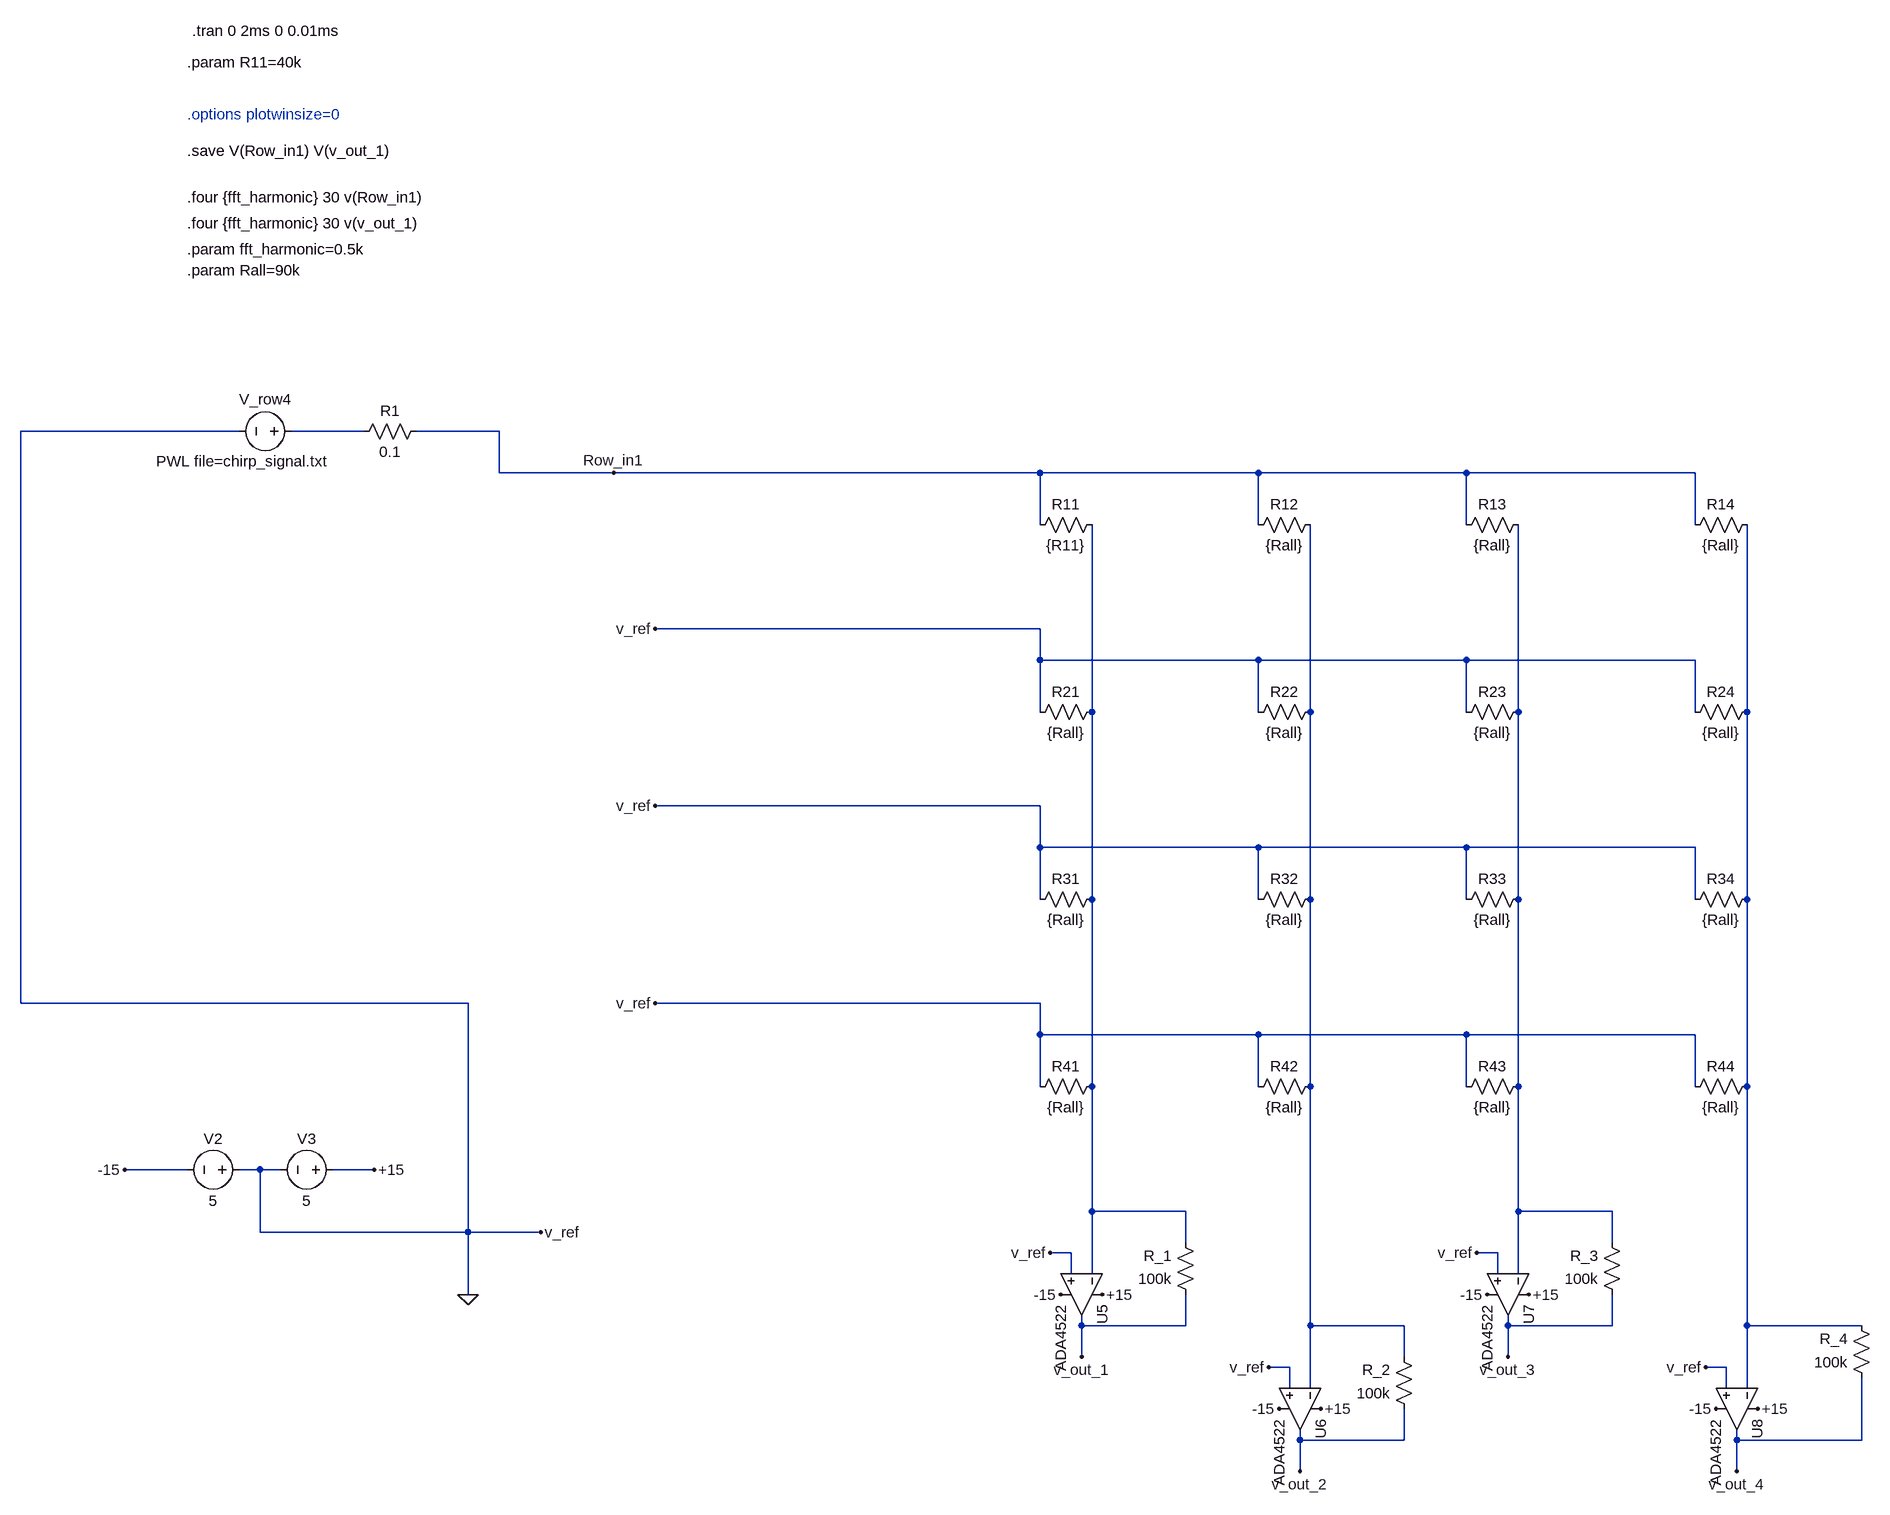
[diagram p0: schematic 06_Linear_Chirp.asc]
06_Linear_Chirp.asc, the LTspice schematic file:
Version 4
SHEET 1 880 880
WIRE -4512 -896 -4848 -896
WIRE -4320 -896 -4432 -896
WIRE -4112 -896 -4240 -896
WIRE -4112 -832 -4112 -896
WIRE -3936 -832 -4112 -832
WIRE -3280 -832 -3936 -832
WIRE -2944 -832 -3280 -832
WIRE -2624 -832 -2944 -832
WIRE -2272 -832 -2624 -832
WIRE -3280 -752 -3280 -832
WIRE -2944 -752 -2944 -832
WIRE -2624 -752 -2624 -832
WIRE -2272 -752 -2272 -832
WIRE -3280 -592 -3872 -592
WIRE -3280 -544 -3280 -592
WIRE -2944 -544 -3280 -544
WIRE -2624 -544 -2944 -544
WIRE -2272 -544 -2624 -544
WIRE -3280 -464 -3280 -544
WIRE -3200 -464 -3200 -752
WIRE -2944 -464 -2944 -544
WIRE -2864 -464 -2864 -752
WIRE -2624 -464 -2624 -544
WIRE -2544 -464 -2544 -752
WIRE -2272 -464 -2272 -544
WIRE -2192 -464 -2192 -752
WIRE -3280 -320 -3872 -320
WIRE -3280 -256 -3280 -320
WIRE -2944 -256 -3280 -256
WIRE -2624 -256 -2944 -256
WIRE -2272 -256 -2624 -256
WIRE -3280 -176 -3280 -256
WIRE -3200 -176 -3200 -464
WIRE -2944 -176 -2944 -256
WIRE -2864 -176 -2864 -464
WIRE -2624 -176 -2624 -256
WIRE -2544 -176 -2544 -464
WIRE -2272 -176 -2272 -256
WIRE -2192 -176 -2192 -464
WIRE -4848 -16 -4848 -896
WIRE -4160 -16 -4848 -16
WIRE -3280 -16 -3872 -16
WIRE -3280 32 -3280 -16
WIRE -2944 32 -3280 32
WIRE -2624 32 -2944 32
WIRE -2272 32 -2624 32
WIRE -3280 112 -3280 32
WIRE -3200 112 -3200 -176
WIRE -2944 112 -2944 32
WIRE -2864 112 -2864 -176
WIRE -2624 112 -2624 32
WIRE -2544 112 -2544 -176
WIRE -2272 112 -2272 32
WIRE -2192 112 -2192 -176
WIRE -4592 240 -4688 240
WIRE -4480 240 -4512 240
WIRE -4448 240 -4480 240
WIRE -4304 240 -4368 240
WIRE -3200 304 -3200 112
WIRE -3056 304 -3200 304
WIRE -2544 304 -2544 112
WIRE -2400 304 -2544 304
WIRE -4480 336 -4480 240
WIRE -4160 336 -4160 -16
WIRE -4160 336 -4480 336
WIRE -4048 336 -4160 336
WIRE -3056 352 -3056 304
WIRE -2400 352 -2400 304
WIRE -3232 368 -3264 368
WIRE -2576 368 -2608 368
WIRE -3232 400 -3232 368
WIRE -3200 400 -3200 304
WIRE -2576 400 -2576 368
WIRE -2544 400 -2544 304
WIRE -4160 432 -4160 336
WIRE -3216 480 -3216 464
WIRE -3056 480 -3056 432
WIRE -3056 480 -3216 480
WIRE -2864 480 -2864 112
WIRE -2720 480 -2864 480
WIRE -2560 480 -2560 464
WIRE -2400 480 -2400 432
WIRE -2400 480 -2560 480
WIRE -2192 480 -2192 112
WIRE -2016 480 -2192 480
WIRE -3216 528 -3216 480
WIRE -2720 528 -2720 480
WIRE -2560 528 -2560 480
WIRE -2896 544 -2928 544
WIRE -2224 544 -2256 544
WIRE -2896 576 -2896 544
WIRE -2864 576 -2864 480
WIRE -2224 576 -2224 544
WIRE -2192 576 -2192 480
WIRE -2880 656 -2880 640
WIRE -2720 656 -2720 608
WIRE -2720 656 -2880 656
WIRE -2208 656 -2208 640
WIRE -2016 656 -2016 560
WIRE -2016 656 -2208 656
WIRE -2880 704 -2880 656
WIRE -2208 704 -2208 656
FLAG -4160 432 0
FLAG -4304 240 +15
FLAG -4688 240 -15
FLAG -3184 432 +15
FLAG -3248 432 -15
FLAG -3264 368 v_ref
FLAG -4048 336 v_ref
FLAG -2848 608 +15
FLAG -2912 608 -15
FLAG -2928 544 v_ref
FLAG -2528 432 +15
FLAG -2592 432 -15
FLAG -2608 368 v_ref
FLAG -2176 608 +15
FLAG -2240 608 -15
FLAG -2256 544 v_ref
FLAG -3216 528 v_out_1
FLAG -2880 704 v_out_2
FLAG -2560 528 v_out_3
FLAG -2208 704 v_out_4
FLAG -3936 -832 Row_in1
FLAG -3872 -16 v_ref
FLAG -3872 -320 v_ref
FLAG -3872 -592 v_ref
SYMBOL voltage -4496 240 R90
WINDOW 0 -32 56 VBottom 2
WINDOW 3 32 56 VTop 2
WINDOW 123 0 0 Left 0
WINDOW 39 0 0 Left 0
SYMATTR InstName V2
SYMATTR Value 5
SYMBOL voltage -4352 240 R90
WINDOW 0 -32 56 VBottom 2
WINDOW 3 32 56 VTop 2
WINDOW 123 0 0 Left 0
WINDOW 39 0 0 Left 0
SYMATTR InstName V3
SYMATTR Value 5
SYMBOL res -3184 -768 R90
WINDOW 0 0 56 VBottom 2
WINDOW 3 32 56 VTop 2
SYMATTR InstName R11
SYMATTR Value {R11}
SYMBOL res -2848 -768 R90
WINDOW 0 0 56 VBottom 2
WINDOW 3 32 56 VTop 2
SYMATTR InstName R12
SYMATTR Value {Rall}
SYMBOL res -2528 -768 R90
WINDOW 0 0 56 VBottom 2
WINDOW 3 32 56 VTop 2
SYMATTR InstName R13
SYMATTR Value {Rall}
SYMBOL res -2176 -768 R90
WINDOW 0 0 56 VBottom 2
WINDOW 3 32 56 VTop 2
SYMATTR InstName R14
SYMATTR Value {Rall}
SYMBOL res -3184 -480 R90
WINDOW 0 0 56 VBottom 2
WINDOW 3 32 56 VTop 2
SYMATTR InstName R21
SYMATTR Value {Rall}
SYMBOL res -2848 -480 R90
WINDOW 0 0 56 VBottom 2
WINDOW 3 32 56 VTop 2
SYMATTR InstName R22
SYMATTR Value {Rall}
SYMBOL res -2528 -480 R90
WINDOW 0 0 56 VBottom 2
WINDOW 3 32 56 VTop 2
SYMATTR InstName R23
SYMATTR Value {Rall}
SYMBOL res -2176 -480 R90
WINDOW 0 0 56 VBottom 2
WINDOW 3 32 56 VTop 2
SYMATTR InstName R24
SYMATTR Value {Rall}
SYMBOL res -3184 -192 R90
WINDOW 0 0 56 VBottom 2
WINDOW 3 32 56 VTop 2
SYMATTR InstName R31
SYMATTR Value {Rall}
SYMBOL res -2848 -192 R90
WINDOW 0 0 56 VBottom 2
WINDOW 3 32 56 VTop 2
SYMATTR InstName R32
SYMATTR Value {Rall}
SYMBOL res -2528 -192 R90
WINDOW 0 0 56 VBottom 2
WINDOW 3 32 56 VTop 2
SYMATTR InstName R33
SYMATTR Value {Rall}
SYMBOL res -2176 -192 R90
WINDOW 0 0 56 VBottom 2
WINDOW 3 32 56 VTop 2
SYMATTR InstName R34
SYMATTR Value {Rall}
SYMBOL res -3184 96 R90
WINDOW 0 0 56 VBottom 2
WINDOW 3 32 56 VTop 2
SYMATTR InstName R41
SYMATTR Value {Rall}
SYMBOL res -2848 96 R90
WINDOW 0 0 56 VBottom 2
WINDOW 3 32 56 VTop 2
SYMATTR InstName R42
SYMATTR Value {Rall}
SYMBOL res -2528 96 R90
WINDOW 0 0 56 VBottom 2
WINDOW 3 32 56 VTop 2
SYMATTR InstName R43
SYMATTR Value {Rall}
SYMBOL res -2176 96 R90
WINDOW 0 0 56 VBottom 2
WINDOW 3 32 56 VTop 2
SYMATTR InstName R44
SYMATTR Value {Rall}
SYMBOL res -3040 448 R180
WINDOW 0 36 76 Left 2
WINDOW 3 36 40 Left 2
SYMATTR InstName R_1
SYMATTR Value 100k
SYMBOL res -2704 624 R180
WINDOW 0 36 76 Left 2
WINDOW 3 36 40 Left 2
SYMATTR InstName R_2
SYMATTR Value 100k
SYMBOL res -2384 448 R180
WINDOW 0 36 76 Left 2
WINDOW 3 36 40 Left 2
SYMATTR InstName R_3
SYMATTR Value 100k
SYMBOL res -2000 576 R180
WINDOW 0 36 76 Left 2
WINDOW 3 36 40 Left 2
SYMATTR InstName R_4
SYMATTR Value 100k
SYMBOL OpAmps\\ADA4522 -3152 432 R90
SYMATTR InstName U5
SYMBOL OpAmps\\ADA4522 -2816 608 R90
SYMATTR InstName U6
SYMBOL OpAmps\\ADA4522 -2496 432 R90
SYMATTR InstName U7
SYMBOL OpAmps\\ADA4522 -2144 608 R90
SYMATTR InstName U8
SYMBOL voltage -4416 -896 R90
WINDOW 3 46 -41 VRight 2
WINDOW 0 -49 14 VRight 2
WINDOW 39 0 0 Left 0
SYMATTR Value PWL file=chirp_signal.txt
SYMATTR InstName V_row4
SYMATTR Value2 AC .1
SYMBOL res -4224 -912 R90
WINDOW 0 0 56 VBottom 2
WINDOW 3 32 56 VTop 2
SYMATTR InstName R1
SYMATTR Value 0.1
TEXT -4592 -1328 Left 2 !.save V(Row_in1) V(v_out_1)
TEXT -4592 -1384 Left 2 ;.options plotwinsize=0
TEXT -4592 -1256 Left 2 !.four {fft_harmonic} 30 v(Row_in1)
TEXT -4592 -1464 Left 2 !.param R11=40k
TEXT -4584 -1512 Left 2 !.tran 0 2ms 0 0.01ms
TEXT -4592 -1176 Left 2 !.param fft_harmonic=0.5k
TEXT -4592 -1144 Left 2 !.param Rall=90k
TEXT -4592 -1216 Left 2 !.four {fft_harmonic} 30 v(v_out_1)

The netlist it stands for:
* 06_Linear_Chirp.asc
V2 0 -15 5
V3 +15 0 5
R11 N002 Row_in1 {R11}
R12 N003 Row_in1 {Rall}
R13 N004 Row_in1 {Rall}
R14 N005 Row_in1 {Rall}
R21 N002 0 {Rall}
R22 N003 0 {Rall}
R23 N004 0 {Rall}
R24 N005 0 {Rall}
R31 N002 0 {Rall}
R32 N003 0 {Rall}
R33 N004 0 {Rall}
R34 N005 0 {Rall}
R41 N002 0 {Rall}
R42 N003 0 {Rall}
R43 N004 0 {Rall}
R44 N005 0 {Rall}
R_1 v_out_1 N002 100k
R_2 v_out_2 N003 100k
R_3 v_out_3 N004 100k
R_4 v_out_4 N005 100k
XU5 0 N002 +15 -15 v_out_1 ADA4522  ; pins In+ In- V+ V- OUT
XU6 0 N003 +15 -15 v_out_2 ADA4522  ; pins In+ In- V+ V- OUT
XU7 0 N004 +15 -15 v_out_3 ADA4522  ; pins In+ In- V+ V- OUT
XU8 0 N005 +15 -15 v_out_4 ADA4522  ; pins In+ In- V+ V- OUT
V_row4 N001 0 PWL file=chirp_signal.txt AC .1
R1 Row_in1 N001 0.1
.save V(Row_in1) V(v_out_1)
* .options plotwinsize=0
.four {fft_harmonic} 30 v(Row_in1)
.param R11=40k
.tran 0 2ms 0 0.01ms
.param fft_harmonic=0.5k
.param Rall=90k
.four {fft_harmonic} 30 v(v_out_1)
.backanno
.end